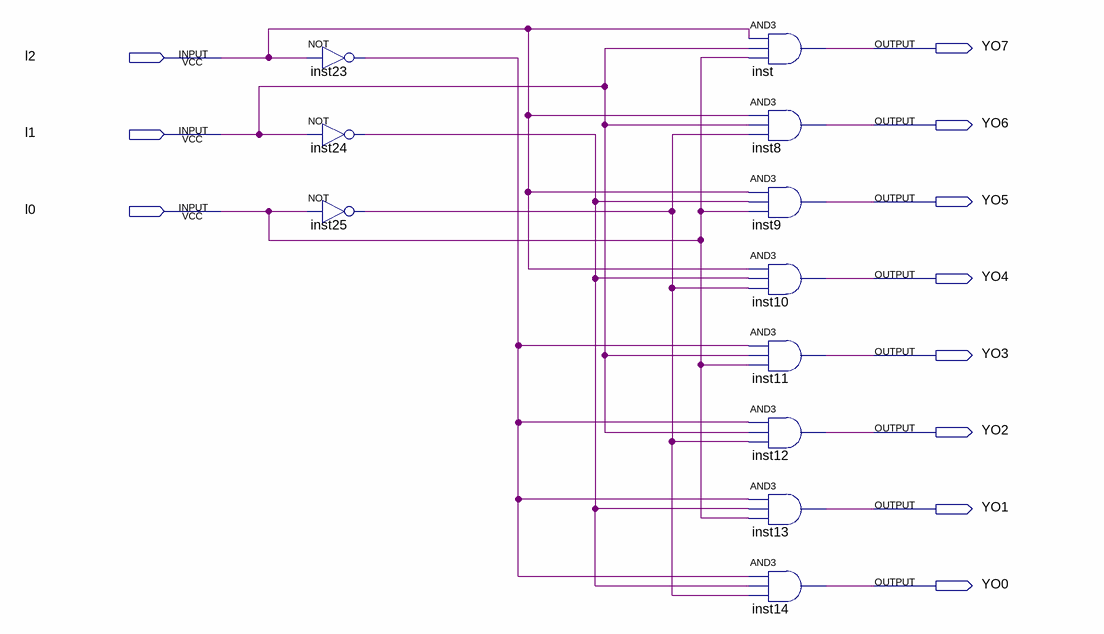
[diagram p0: schematic sheet]
// Quartus schematic My_38.bdf as structural Verilog: 11 symbols, 11 pins
module My_38 (
  input  l2,
  input  l1,
  input  l0,
  output YO7,
  output YO6,
  output YO5,
  output YO4,
  output YO3,
  output YO2,
  output YO1,
  output YO0
);

  wire inst23_out, inst24_out, inst25_out;

  not inst23 (inst23_out, l2);
  not inst24 (inst24_out, l1);
  not inst25 (inst25_out, l0);
  and inst (YO7, l2, l1, l0);
  and inst8 (YO6, l2, l1, inst25_out);
  and inst9 (YO5, l2, inst24_out, l0);
  and inst10 (YO4, l2, inst24_out, inst25_out);
  and inst11 (YO3, inst23_out, l1, l0);
  and inst12 (YO2, inst23_out, l1, inst25_out);
  and inst13 (YO1, inst23_out, inst24_out, l0);
  and inst14 (YO0, inst23_out, inst24_out, inst25_out);
endmodule
